# EAGLE design panelmutlimec1 (EAGLE 5.06)
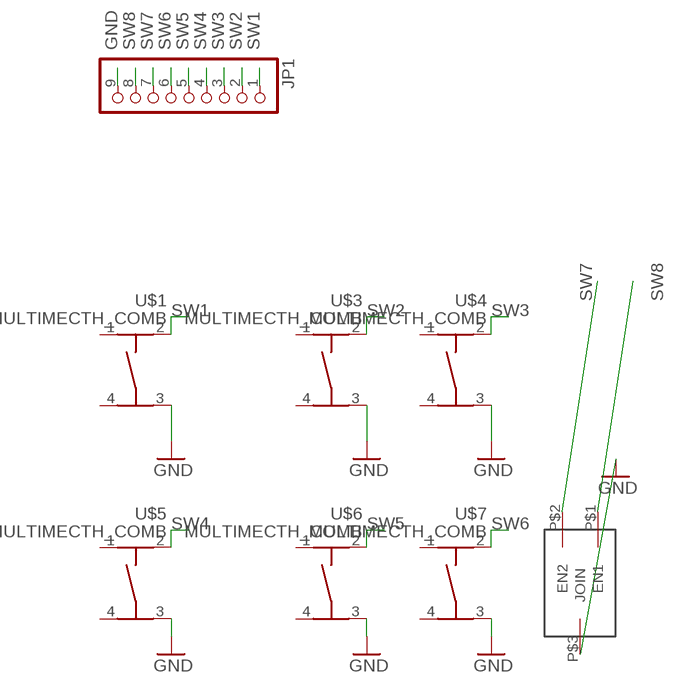
[diagram p0: schematic, sheet 1]

## Parts
JP1  PINHD-1X9  [1X09]
U$1  MULTIMECTH_COMB  [MULTIMEC_COMB]
U$2  MYENCODER  [MYPAC]
U$3  MULTIMECTH_COMB  [MULTIMEC_COMB]
U$4  MULTIMECTH_COMB  [MULTIMEC_COMB]
U$5  MULTIMECTH_COMB  [MULTIMEC_COMB]
U$6  MULTIMECTH_COMB  [MULTIMEC_COMB]
U$7  MULTIMECTH_COMB  [MULTIMEC_COMB]

## Nets
GND: JP1.9 U$1.3 U$2.P$3(JOIN) U$3.3 U$4.3 U$5.3 U$6.3 U$7.3
SW1: JP1.1 U$1.2
SW2: JP1.2 U$3.2
SW3: JP1.3 U$4.2
SW4: JP1.4 U$5.2
SW5: JP1.5 U$6.2
SW6: JP1.6 U$7.2
SW7: JP1.7 U$2.P$2(EN2)
SW8: JP1.8 U$2.P$1(EN1)
Unconnected: U$1.1 U$1.4 U$3.1 U$3.4 U$4.1 U$4.4 U$5.1 U$5.4 U$6.1 U$6.4 U$7.1 U$7.4

## Library data of the parts
JP1 = pinhead:PINHD-1X9: PIN HEADER
U$1 U$3-U$7 = taster:MULTIMEC: multimec switch smd type
U$2 = myencoder:MYENCODER

## Net classes
0 default: width 0.305 mm, drill 0.051 mm, clearance 0.051 mm

## Board
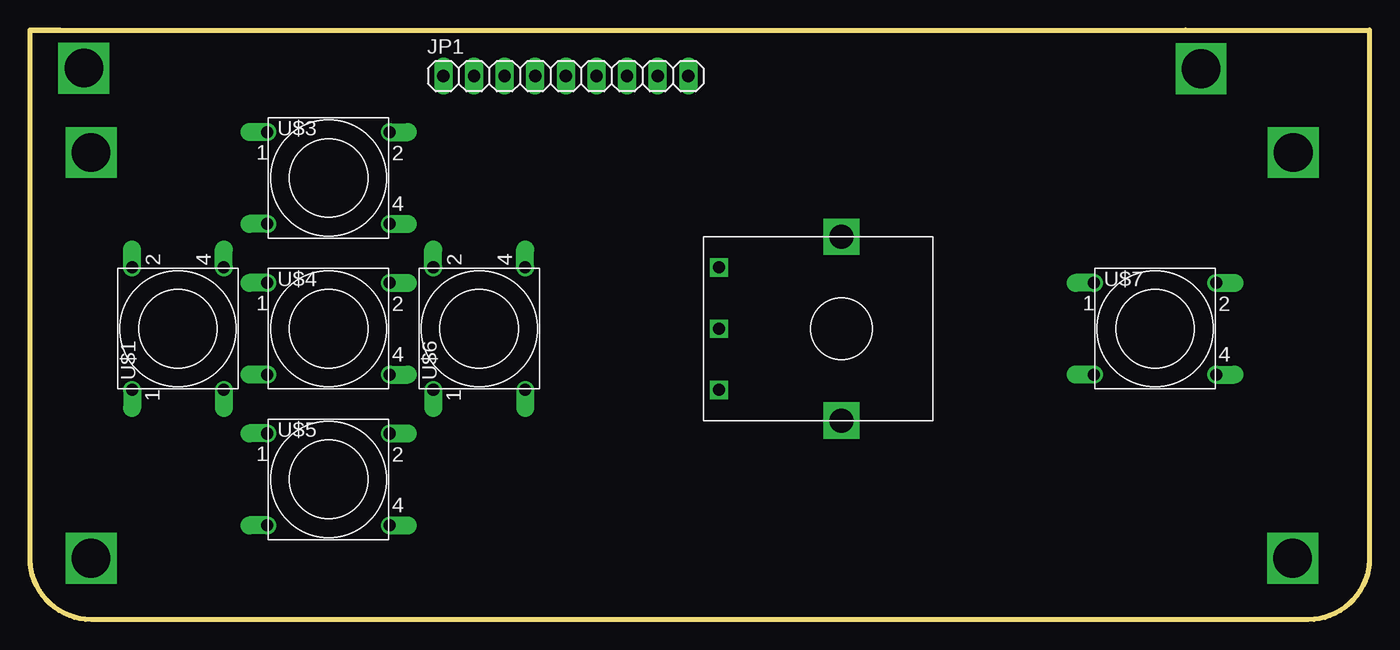
[diagram p1: board, top side]
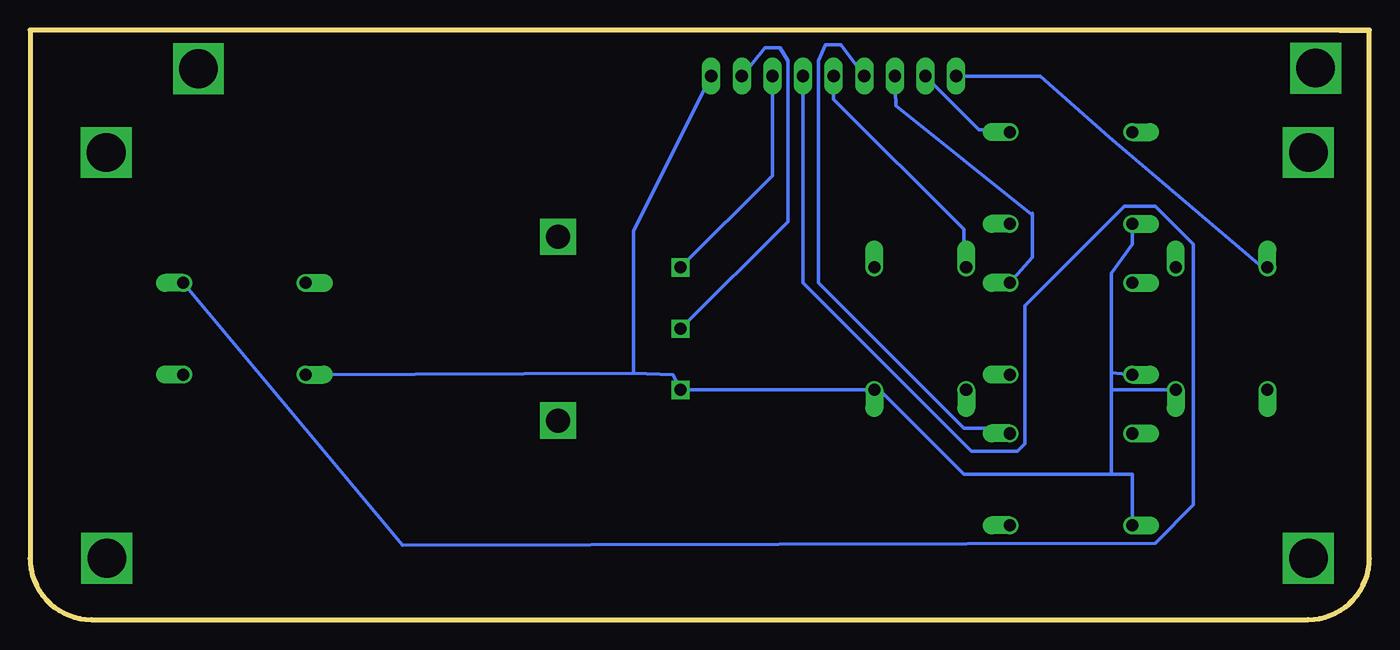
[diagram p2: board, bottom side, seen from below]

Size 111.12 x 48.9 mm. Coordinates in mm from the lower left corner, seen from the top.
Outline: 2.48,48.9 0,48.9
Outline: 0,48.9 95.89,48.9 111.12,48.9 111.12,5.08 arc-90 106.05,0 5.08,0 arc-90 0,5.08 0,48.9
Copper layers (1*16): Top 0.035mm / dielectric 1.5mm / Bottom 0.035mm
Design rules "default *": minimum track width 10mil, minimum drill 24mil, track to track 8mil, track to pad 8mil, pad to pad 8mil, via to via 8mil, smd to smd 8mil, copper to edge 40mil, drill to drill 8mil, minimum pad ring 10mil, minimum via ring 8mil, stop-mask expansion 4mil, vias tented up to drill 0mil, thermal gap 10mil

### Footprints (pad centres in the part's own frame; a part is rotated, then mirrored left to right if it is on the bottom)
1X09 = drill 1.016 long: 1 -10.16,0; 2 -7.62,0; 3 -5.08,0; 4 -2.54,0; 5 0,0; 6 2.54,0; 7 5.08,0; 8 7.62,0; 9 10.16,0
MULTIMEC_COMB = drill 1 offset: 1 -5.08,3.81; 2 5.08,3.81; 3 -5.08,-3.81; 4 5.08,-3.81
MYPAC = drill 1 square: P$1 0,-5.08; P$2 -5.08,-5.08; P$3 5.08,-5.08 | drill 2 square: P$4 -7.62,5.08; P$5 7.62,5.08

### Placement (x,y rotation side)
JP1  44.45,45.09 0 top
U$1  12.26,24.13 90 top
U$2  62.23,24.13 270 top
U$3  24.76,36.63 0 top
U$4  24.76,24.13 0 top
U$5  24.76,11.63 0 top
U$6  37.27,24.13 90 top
U$7  93.34,24.13 0 top

### Tracks (layer width: path | path; a pad name or v marks a point on that pad's centre or on a via)
GND
  Bottom 0.305: 21.4,19.05 21.4,20.47 | 21.4,19.05 16.51,19.05 U$1.3 | 21.4,20.47 U$4.3 | 19.68,12.07 19.68,8.26 U$5.3 | 19.68,12.07 21.4,12.07 | 21.4,12.07 21.4,19.05 | 21.4,19.05 21.4,20.47 | 21.4,20.47 21.4,28.73 19.68,31.12 19.68,32.39 U$3.3 | 61.05,20.42 57.77,20.32 U$2.P$3 41.28,19.05 U$6.3 40.64,19.05 33.66,12.07 21.4,12.07 | 61.05,20.42 U$7.3 | JP1.9 61.06,32.26 61.05,20.42 | 19.68,12.07 21.4,12.07
N$1  (via drill 3.2)
  other vias: 104.76,5.09
N$2  (via drill 3.2)
  other vias: 5.06,5.09
N$3  (via drill 3.2)
  other vias: 5.06,38.74
N$4  (via drill 3.2)
  other vias: 4.46,45.74
N$5  (via drill 3.2)
  other vias: 97.16,45.69
N$6  (via drill 3.2)
  other vias: 104.81,38.74
SW1
  Bottom 0.305: JP1.1 27.3,45.09 21.59,40.01 8.89,29.21 U$1.2
SW2
  Bottom 0.305: JP1.2 32.39,40.64 29.84,40.64 U$3.2
SW3
  Bottom 0.305: U$4.2 27.96,30.04 27.96,33.7 28,33.59 39.27,42.62 JP1.3
SW4
  Bottom 0.305: JP1.4 43.87,47.69 45.14,47.69 45.72,46.36 45.72,27.94 33.66,15.88 29.84,15.88 U$5.2
SW5
  Bottom 0.305: JP1.5 44.45,43.18 33.66,32.39 33.66,29.21 U$6.2
SW6
  Bottom 0.305: U$7.2 80.23,6.15 17.78,6.35 14.61,9.52 14.61,31.12 17.78,34.29 20.32,34.29 28.57,26.04 28.57,14.61 29.21,13.97 33.02,13.97 46.99,27.94 JP1.6
SW7
  Bottom 0.305: JP1.7 49.53,36.83 U$2.P$2
SW8
  Bottom 0.305: JP1.8 50.17,47.44 48.89,47.44 48.26,46.36 48.26,33.02 U$2.P$1